# EAGLE schematic reveller-pi-B+HAT (EAGLE 7.5.0)
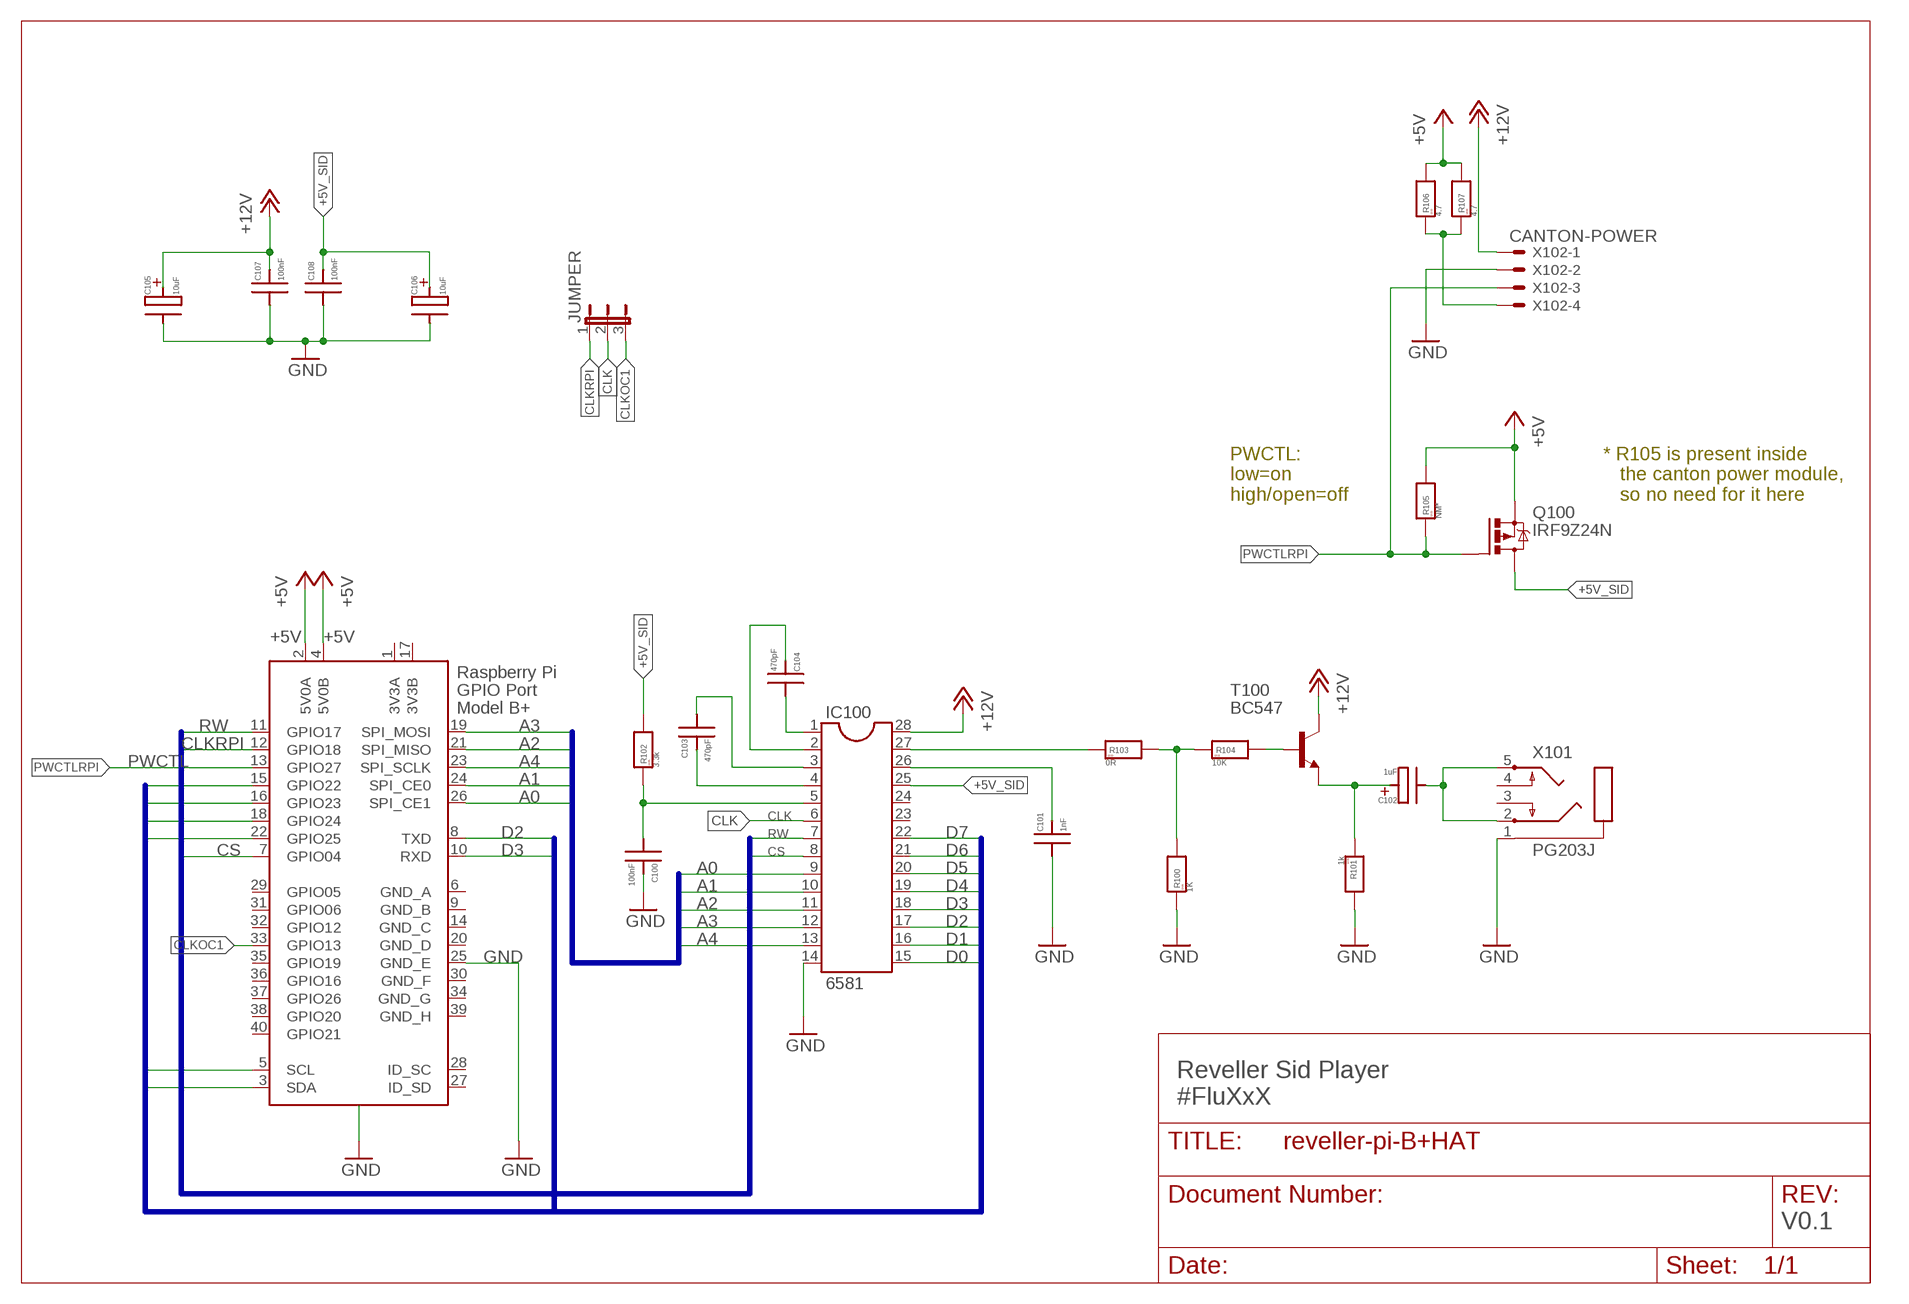
[diagram p0: schematic, sheet 1]

## Parts
C100  100nF  SMD-IPC_CAPC1206  [SMD-IPC_C1206]
C101  1nF  SMD-IPC_CAPC1206  [SMD-IPC_C1206]
C102  1uF  SMD-IPC_CAPPOLPXE_H  [PXE-H]
C103  470pF  SMD-IPC_CAPC1206  [SMD-IPC_C1206]
C104  470pF  SMD-IPC_CAPC1206  [SMD-IPC_C1206]
C105  10uF  SMD-IPC_CAPPOLC7343  [SMD-IPC_CT7343]
C106  10uF  SMD-IPC_CAPPOLC7343  [SMD-IPC_CT7343]
C107  100nF  SMD-IPC_CAPC1206  [SMD-IPC_C1206]
C108  100nF  SMD-IPC_CAPC1206  [SMD-IPC_C1206]
IC100  6581  DIL28  [DIL28-6]
JUMPER  JP2W  [JP2W]
Q100  IRF9Z24N  IRF9530  [TO220BV]
R100  1K  SMD-IPC_RESR1206  [SMD-IPC_R1206]
R101  1k  SMD-IPC_RESR1206  [SMD-IPC_R1206]
R102  3.3k  SMD-IPC_RESR1206  [SMD-IPC_R1206]
R103  0R  SMD-IPC_RESR1206  [SMD-IPC_R1206]
R104  10K  SMD-IPC_RESR1206  [SMD-IPC_R1206]
R105  NM*  SMD-IPC_RESR1206  [SMD-IPC_R1206]
R106  4.7  SMD-IPC_RESR1206  [SMD-IPC_R1206]
R107  4.7  SMD-IPC_RESR1206  [SMD-IPC_R1206]
T100  BC547  [TO92]
X1  RASPI_BOARD_B+#_HDC  [RASPI_BOARD_B+HAT_DF_CF]
X101  PG203J  [PG203J]
X102  CANTON-POWER  22-23-2041  [22-23-2041]

## Nets
5VSTABIL: R106.1 R107.1 X102.4
+5V: Q100.S R105.2 R106.2 R107.2 X1.2(5V0A) X1.4(5V0B)
+5V_SID: C106.+ C108.+ IC100.25 Q100.D R102.2
+12V: C105.+ C107.+ IC100.28 T100.3(C) X102.1
A0 [data]: IC100.9 X1.26(SPI_CE1)
A1 [data]: IC100.10 X1.24(SPI_CE0)
A2 [data]: IC100.11 X1.21(SPI_MISO)
A3 [data]: IC100.12 X1.19(SPI_MOSI)
A4 [data]: IC100.13 X1.23(SPI_SCLK)
AUDIO_DC: C102.+ R101.1 T100.1(E)
AUDIO_OUT: C102.- X101.2 X101.5
AUDIO_PREAMP: R100.2 R103.2 R104.1
AUDIO_PREAMP_B: R104.2 T100.2(B)
AUDIO_RAW: IC100.27 R103.1
CAP1A: C104.- IC100.1
CAP1B: C104.+ IC100.2
CAP2A: C103.- IC100.3
CAP2B: C103.+ IC100.4
CAPX: C101.+ IC100.26
CLK [data]: IC100.6 JUMPER.2
CLKOC1: JUMPER.3 X1.33(GPIO13)
CLKRPI [data]: JUMPER.1 X1.12(GPIO18)
CS [data]: IC100.8 X1.7(GPIO04)
D0 [data]: IC100.15 X1.3(SDA)
D1 [data]: IC100.16 X1.5(SCL)
D2 [data]: IC100.17 X1.8(TXD)
D3 [data]: IC100.18 X1.10(RXD)
D4 [data]: IC100.19 X1.15(GPIO22)
D5 [data]: IC100.20 X1.16(GPIO23)
D6 [data]: IC100.21 X1.18(GPIO24)
D7 [data]: IC100.22 X1.22(GPIO25)
GND: C100.+ C101.- C105.- C106.- C107.- C108.- IC100.14 R100.1 R101.2 X101.1 X102.2
PWCTL [data]: X1.13(GPIO27)
PWCTLRPI [data]: Q100.G R105.1 X102.3
RESET: C100.- IC100.5 R102.1
RW [data]: IC100.7 X1.11(GPIO17)
Unconnected: IC100.23 IC100.24 X1.27(ID_SD) X1.28(ID_SC) X1.29(GPIO05) X1.31(GPIO06) X1.32(GPIO12) X1.35(GPIO19) X1.36(GPIO16) X1.37(GPIO26) X1.38(GPIO20) X1.40(GPIO21) X101.3 X101.4

## Buses
A[0..4]
D[0..7]
CLK,RW,CS

## Notes on the sheet
- PWCTL:
  low=on
  high/open=off
- * R105 is present inside
     the canton power module,
     so no need for it here
- Reveller Sid Player
  #FluXxX
- V0.1

## Power pins joined to a net without a drawn wire
3V3A: X1.1(3V3A)
3V3B: X1.17(3V3B)
GND_A: X1.6(GND_A)
GND_B: X1.9(GND_B)
GND_C: X1.14(GND_C)
GND_D: X1.20(GND_D)
GND_E: X1.25(GND_E)
GND_F: X1.30(GND_F)
GND_G: X1.34(GND_G)
GND_H: X1.39(GND_H)

## Library data of the parts
C100 C101 C103 C104 C107 C108 = cyviz:SMD-IPC_CAP: Capacitor, non polarized
C102 C105 C106 = cyviz:SMD-IPC_CAPPOL: Polarized capacitor
IC100 = ic-package:DIL28: Dual In Line
JUMPER = jumper:JP2W: JUMPER
Q100 = transistor-power:IRF9530: P-CHANNEL HEXFET POWER-MOS-FET Source: http://www.irf.com/product-info/datasheets/data/irf9530.pdf
R100-R107 = cyviz:SMD-IPC_RES: Resistor; SIZE: 1206
T100 = transistor:BC547: NPN TRANSISTOR
X1 = raspberrypi_bastelstube_v13:RASPI_BOARD_B+#: Raspberry Pi GPIO connector with markings for the outer dimensions of the Raspberry Pi board model B+ with different sets of drill holes or mounting pads All pins connected
X101 = con-hirschmann:PG203J: MIC/HEADPHONE JACK KS-S stereo microphone/headphone jack PG203JN (Schukat); OC_FARNELL: unknown; OC_NEWARK: unknown
X102 = con-molex:22-23-2041: .100" (2.54mm) Center Header - 4 Pin; MF: MOLEX; MPN: 22-23-2041; OC_FARNELL: 1462920; OC_NEWARK: 38C0355

## Net classes
0 default: clearance 0.205 mm
1 data: width 0.3 mm, drill 0.8 mm